# Altium project Asterisk Main Board.PrjPCB
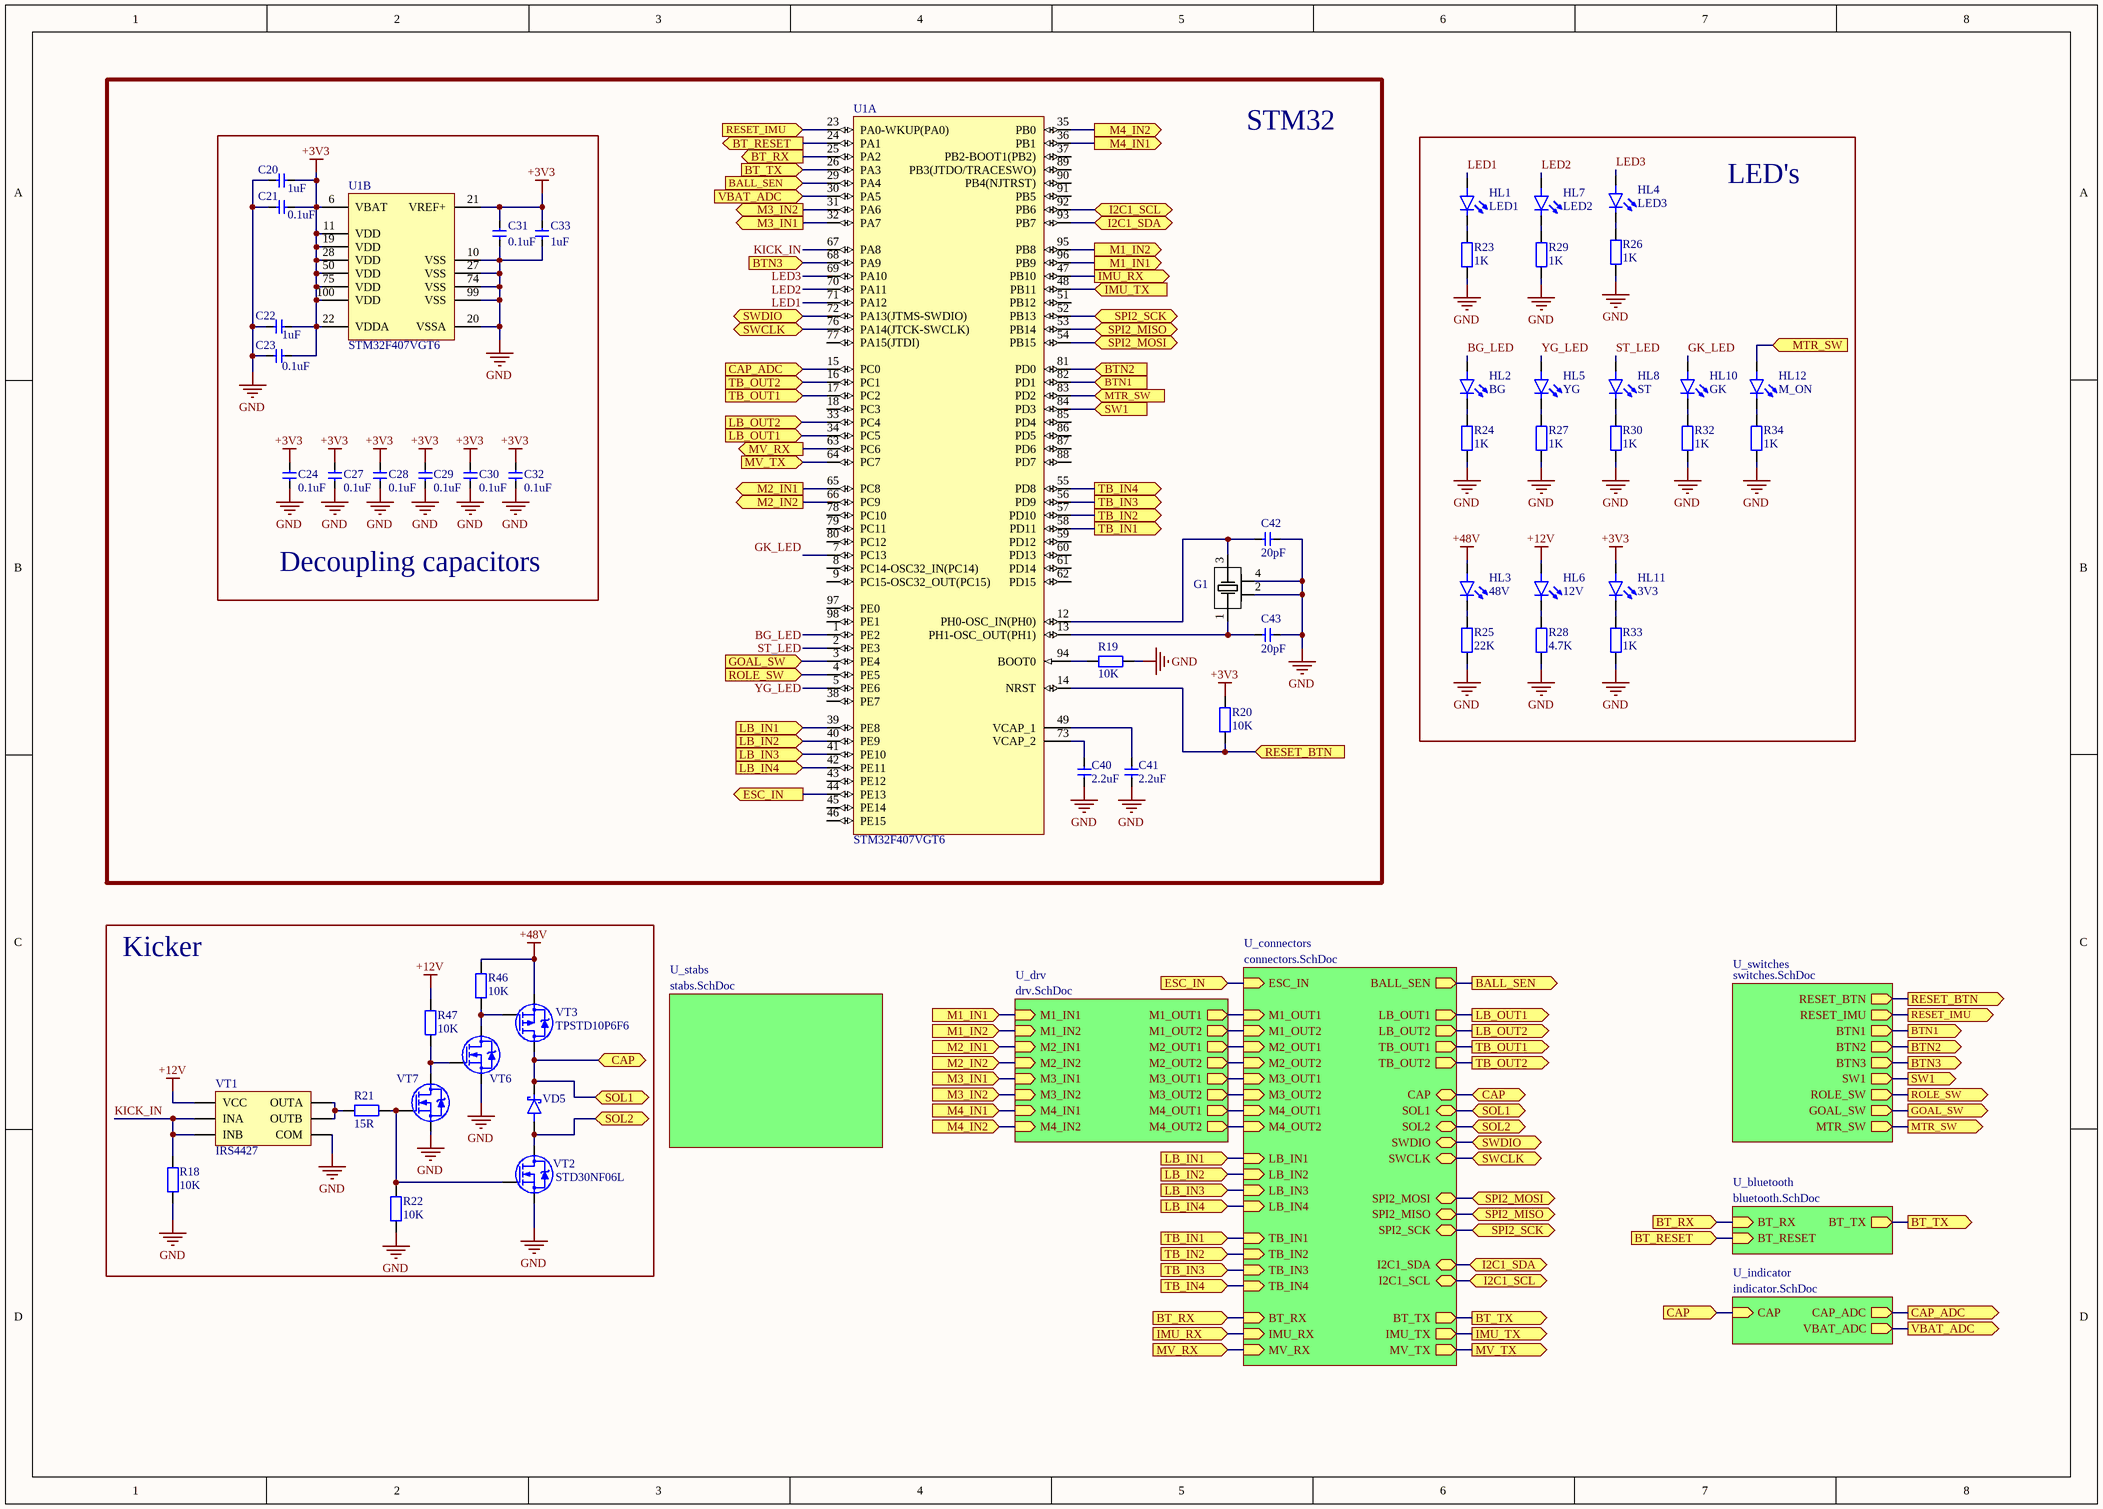
[diagram p0: main.SchDoc]
6 sheets, 167 parts. Net scope: hierarchical (ports join the sheet entries above them; power ports are global).
Board file: main.PcbDoc
Sheets:
  main.SchDoc
    U_drv = drv.SchDoc
    U_bluetooth = bluetooth.SchDoc
    U_indicator = indicator.SchDoc
    U_connectors = connectors.SchDoc
    U_stabs = stabs.SchDoc

## Sheet main.SchDoc
size A3

### Parts
C20  1uF  [CAP0805]
C21  0.1uF  [CAP0805]
C22  1uF  [CAP0805]
C23  0.1uF  [CAP0805]
C24  0.1uF  [CAP0805]
C27  0.1uF  [CAP0805]
C28  0.1uF  [CAP0805]
C29  0.1uF  [CAP0805]
C30  0.1uF  [CAP0805]
C31  0.1uF  [CAP0805]
C32  0.1uF  [CAP0805]
C33  1uF  [CAP0805]
C40  2.2uF  [CAP0805]
C41  2.2uF  [CAP0805]
C42  20pF  [CAP0805]
C43  20pF  [CAP0805]
G1  8 MHz  [TSX-3225]  (value not drawn)
HL1  LED1  [LED0603_WHITE]
HL2  BG  [LED0603_WHITE]
HL3  48V  [LED0603_GREEN]
HL4  LED3  [LED0603_WHITE]
HL5  YG  [LED0603_WHITE]
HL6  12V  [LED0603_GREEN]
HL7  LED2  [LED0603_WHITE]
HL8  ST  [LED0603_WHITE]
HL10  GK  [LED0603_WHITE]
HL11  3V3  [LED0603_GREEN]
HL12  M_ON  [LED0603_RED]
R18  10K  [RES0805]
R19  10K  [RES0805]
R20  10K  [RES0805]
R21  15R  [RES1206]
R22  10K  [RES0805]
R23  1K  [RES0805]
R24  1K  [RES0805]
R25  22K  [RES0805]
R26  1K  [RES0805]
R27  1K  [RES0805]
R28  4.7K  [RES0805]
R29  1K  [RES0805]
R30  1K  [RES0805]
R32  1K  [RES0805]
R33  1K  [RES0805]
R34  1K  [RES0805]
R46  10K  [RES0805]
R47  10K  [RES0805]
U1  STM32F407VGT6  [LQFP100]  (parts A,B of 2)
VD5  Diode Schottky  [DO-214AC (SMA)]  (value not drawn)
VT1  IRS4427  [SOIC-8]
VT2  STD30NF06L  [DPAK]
VT3  TPSTD10P6F6  [DPAK]
VT6  IRLML2502  [SOT-23-3]  (value not drawn)
VT7  IRLML2502  [SOT-23-3]  (value not drawn)

### Blocks framed on the sheet
STM32: C40-C43 G1 R19 R20 U1
Decoupling capacitors: C20-C24 C27-C33 U1
LED's: HL1-HL8 HL10-HL12 R23-R30 R32-R34
Kicker: R18 R21 R22 R46 R47 VD5 VT1-VT3 VT6 VT7

### Sub-sheets
U_bluetooth = bluetooth.SchDoc: BT_TX (out), BT_RX (in), BT_RESET (in)
U_connectors = connectors.SchDoc: ESC_IN (in), M1_OUT1 (in), M1_OUT2 (in), M2_OUT1 (in), M2_OUT2 (in), M3_OUT1 (in), M3_OUT2 (in), M4_OUT1 (in), M4_OUT2 (in), SOL2 (bidir), SOL1 (bidir), CAP (bidir), BALL_SEN (out), SWDIO (bidir), SWCLK (bidir), LB_OUT2 (out), LB_OUT1 (out), LB_IN1 (in), LB_IN2 (in), LB_IN3 (in), LB_IN4 (in), TB_IN1 (in), TB_IN2 (in), TB_IN3 (in), TB_IN4 (in), TB_OUT1 (out), TB_OUT2 (out), BT_TX (out), BT_RX (in), IMU_RX (in), IMU_TX (out), MV_RX (in), MV_TX (out), SPI2_MOSI (bidir), I2C1_SCL (bidir), I2C1_SDA (bidir), SPI2_SCK (bidir), SPI2_MISO (bidir)
U_drv = drv.SchDoc: M1_IN1 (in), M1_IN2 (in), M1_OUT1 (out), M1_OUT2 (out), M2_IN1 (in), M2_IN2 (in), M2_OUT1 (out), M2_OUT2 (out), M4_IN1 (in), M4_IN2 (in), M4_OUT1 (out), M4_OUT2 (out), M3_IN1 (in), M3_IN2 (in), M3_OUT1 (out), M3_OUT2 (out)
U_indicator = indicator.SchDoc: VBAT_ADC (out), CAP (in), CAP_ADC (out)
U_stabs = stabs.SchDoc: no entries
U_switches = switches.SchDoc (file not in this document): RESET_BTN (out), RESET_IMU (out), BTN1 (out), BTN2 (out), BTN3 (out), SW1 (out), ROLE_SW (out), GOAL_SW (out), MTR_SW (out)

### Ports
BALL_SEN (in), BALL_SEN (out), BT_RESET (in), BT_RESET (out), BT_RX (in), BT_RX (out), BT_TX (in), BT_TX (out), BTN1 (in), BTN1 (out), BTN2 (in), BTN2 (out), BTN3 (in), BTN3 (out), CAP (bidir), CAP (in), CAP_ADC (in), CAP_ADC (out), ESC_IN (in), ESC_IN (out), GOAL_SW (in), GOAL_SW (out), I2C1_SCL (bidir), I2C1_SDA (bidir), IMU_RX (in), IMU_RX (out), IMU_TX (in), IMU_TX (out), LB_IN1 (in), LB_IN2 (in), LB_IN3 (in), LB_IN4 (in), LB_OUT1 (in), LB_OUT1 (out), LB_OUT2 (in), LB_OUT2 (out), M1_IN1 (in), M1_IN1 (out), M1_IN2 (in), M1_IN2 (out), M2_IN1 (in), M2_IN1 (out), M2_IN2 (in), M2_IN2 (out), M3_IN1 (in), M3_IN1 (out), M3_IN2 (in), M3_IN2 (out), M4_IN1 (in), M4_IN1 (out), M4_IN2 (in), M4_IN2 (out), MTR_SW (in), MTR_SW (out), MV_RX (in), MV_RX (out), MV_TX (in), MV_TX (out), RESET_BTN (in), RESET_BTN (out), RESET_IMU (in), RESET_IMU (out), ROLE_SW (in), ROLE_SW (out), SOL1 (bidir), SOL2 (bidir), SPI2_MISO (bidir), SPI2_MOSI (bidir), SPI2_SCK (bidir), SW1 (in), SW1 (out), SWCLK (bidir), SWDIO (bidir), TB_IN1 (in), TB_IN1 (out), TB_IN2 (in), TB_IN2 (out), TB_IN3 (in), TB_IN3 (out), TB_IN4 (in), TB_IN4 (out), TB_OUT1 (in), TB_OUT1 (out), TB_OUT2 (in), TB_OUT2 (out), VBAT_ADC (in), VBAT_ADC (out)

### Nets
+3V3: C20.1 C21.1 C22.1 C23.1 C24.1 C27.1 C28.1 C29.1 C30.1 C31.2 C32.1 C33.2 HL11.2(A) R20.1 U1.6(VBAT) U1.11(VDD) U1.19(VDD) U1.21(VREF+) U1.22(VDDA) U1.28(VDD) U1.50(VDD) U1.75(VDD) U1.100(VDD)
+12V: HL6.2(A) R47.2 VT1.6(VCC)
+48V: HL3.2(A) R46.2 VT3.S
GND: C20.2 C21.2 C22.2 C23.2 C24.2 C27.2 C28.2 C29.2 C30.2 C31.1 C32.2 C33.1 C40.1 C41.1 C42.2 C43.2 G1.2 G1.4 R18.1 R19.1 R22.1 R23.1 R24.1 R25.1 R26.1 R27.1 R28.1 R29.1 R30.1 R32.1 R33.1 R34.1 U1.10(VSS) U1.20(VSSA) U1.27(VSS) U1.74(VSS) U1.99(VSS) VT1.3(COM) VT2.S VT6.S VT7.S
BALL_SEN: U1.29(PA4) ; port BALL_SEN, sheet U_connectors/BALL_SEN
BG_LED: HL2.2(A) U1.1(PE2)
BT_RESET: U1.24(PA1) ; port BT_RESET, sheet U_bluetooth/BT_RESET
BT_RX: U1.25(PA2) ; port BT_RX, sheet U_bluetooth/BT_RX, sheet U_connectors/BT_RX
BT_TX: U1.26(PA3) ; port BT_TX, sheet U_bluetooth/BT_TX, sheet U_connectors/BT_TX
BTN1: U1.82(PD1) ; port BTN1, sheet U_switches/BTN1
BTN2: U1.81(PD0) ; port BTN2, sheet U_switches/BTN2
BTN3: U1.68(PA9) ; port BTN3, sheet U_switches/BTN3
CAP: VD5.K VT3.D ; port SOL1, port CAP, sheet U_indicator/CAP, sheet U_connectors/SOL1, sheet U_connectors/CAP
CAP_ADC: U1.15(PC0) ; port CAP_ADC, sheet U_indicator/CAP_ADC
ESC_IN: U1.44(PE13) ; port ESC_IN, sheet U_connectors/ESC_IN
GK_LED: HL10.2(A) U1.7(PC13)
GOAL_SW: U1.3(PE4) ; port GOAL_SW, sheet U_switches/GOAL_SW
I2C1_SCL: U1.92(PB6) ; port I2C1_SCL, sheet U_connectors/I2C1_SCL
I2C1_SDA: U1.93(PB7) ; port I2C1_SDA, sheet U_connectors/I2C1_SDA
IMU_RX: U1.47(PB10) ; port IMU_RX, sheet U_connectors/IMU_RX
IMU_TX: U1.48(PB11) ; port IMU_TX, sheet U_connectors/IMU_TX
KICK_IN: R18.2 U1.67(PA8) VT1.2(INA) VT1.4(INB)
LB_IN1: U1.39(PE8) ; port LB_IN1, sheet U_connectors/LB_IN1
LB_IN2: U1.40(PE9) ; port LB_IN2, sheet U_connectors/LB_IN2
LB_IN3: U1.41(PE10) ; port LB_IN3, sheet U_connectors/LB_IN3
LB_IN4: U1.42(PE11) ; port LB_IN4, sheet U_connectors/LB_IN4
LB_OUT1: U1.34(PC5) ; port LB_OUT1, sheet U_connectors/LB_OUT1
LB_OUT2: U1.33(PC4) ; port LB_OUT2, sheet U_connectors/LB_OUT2
LED1: HL1.2(A) U1.71(PA12)
LED2: HL7.2(A) U1.70(PA11)
LED3: HL4.2(A) U1.69(PA10)
M1_IN1: U1.96(PB9) ; port M1_IN1, sheet U_drv/M1_IN1
M1_IN2: U1.95(PB8) ; port M1_IN2, sheet U_drv/M1_IN2
M1_OUT1: sheet U_drv/M1_OUT1, sheet U_connectors/M1_OUT1
M1_OUT2: sheet U_drv/M1_OUT2, sheet U_connectors/M1_OUT2
M2_IN1: U1.65(PC8) ; port M2_IN1, sheet U_drv/M2_IN1
M2_IN2: U1.66(PC9) ; port M2_IN2, sheet U_drv/M2_IN2
M2_OUT1: sheet U_drv/M2_OUT1, sheet U_connectors/M2_OUT1
M2_OUT2: sheet U_drv/M2_OUT2, sheet U_connectors/M2_OUT2
M3_IN1: U1.32(PA7) ; port M3_IN1, sheet U_drv/M3_IN1
M3_IN2: U1.31(PA6) ; port M3_IN2, sheet U_drv/M3_IN2
M3_OUT1: sheet U_drv/M3_OUT1, sheet U_connectors/M3_OUT1
M3_OUT2: sheet U_drv/M3_OUT2, sheet U_connectors/M3_OUT2
M4_IN1: U1.36(PB1) ; port M4_IN1, sheet U_drv/M4_IN1
M4_IN2: U1.35(PB0) ; port M4_IN2, sheet U_drv/M4_IN2
M4_OUT1: sheet U_drv/M4_OUT1, sheet U_connectors/M4_OUT1
M4_OUT2: sheet U_drv/M4_OUT2, sheet U_connectors/M4_OUT2
MTR_SW: HL12.2(A) U1.83(PD2) ; port MTR_SW, sheet U_switches/MTR_SW
MV_RX: U1.63(PC6) ; port MV_RX, sheet U_connectors/MV_RX
MV_TX: U1.64(PC7) ; port MV_TX, sheet U_connectors/MV_TX
RESET_BTN: R20.2 U1.14(NRST) ; port RESET_BTN, sheet U_switches/RESET_BTN
RESET_IMU: U1.23(PA0-WKUP(PA0)) ; port RESET_IMU, sheet U_switches/RESET_IMU
ROLE_SW: U1.4(PE5) ; port ROLE_SW, sheet U_switches/ROLE_SW
SOL2: VD5.A VT2.D ; port SOL2, sheet U_connectors/SOL2
SPI2_MISO: U1.53(PB14) ; port SPI2_MISO, sheet U_connectors/SPI2_MISO
SPI2_MOSI: U1.54(PB15) ; port SPI2_MOSI, sheet U_connectors/SPI2_MOSI
SPI2_SCK: U1.52(PB13) ; port SPI2_SCK, sheet U_connectors/SPI2_SCK
ST_LED: HL8.2(A) U1.2(PE3)
SW1: U1.84(PD3) ; port SW1, sheet U_switches/SW1
SWCLK: U1.76(PA14(JTCK-SWCLK)) ; port SWCLK, sheet U_connectors/SWCLK
SWDIO: U1.72(PA13(JTMS-SWDIO)) ; port SWDIO, sheet U_connectors/SWDIO
TB_IN1: U1.58(PD11) ; port TB_IN1, sheet U_connectors/TB_IN1
TB_IN2: U1.57(PD10) ; port TB_IN2, sheet U_connectors/TB_IN2
TB_IN3: U1.56(PD9) ; port TB_IN3, sheet U_connectors/TB_IN3
TB_IN4: U1.55(PD8) ; port TB_IN4, sheet U_connectors/TB_IN4
TB_OUT1: U1.17(PC2) ; port TB_OUT1, sheet U_connectors/TB_OUT1
TB_OUT2: U1.16(PC1) ; port TB_OUT2, sheet U_connectors/TB_OUT2
VBAT_ADC: U1.30(PA5) ; port VBAT_ADC, sheet U_indicator/VBAT_ADC
YG_LED: HL5.2(A) U1.5(PE6)
NetC40_2: C40.2 U1.73(VCAP_2)
NetC41_2: C41.2 U1.49(VCAP_1)
NetC42_1: C42.1 G1.3 U1.12(PH0-OSC_IN(PH0))
NetC43_1: C43.1 G1.1 U1.13(PH1-OSC_OUT(PH1))
NetHL1_1: HL1.1(K) R23.2
NetHL2_1: HL2.1(K) R24.2
NetHL3_1: HL3.1(K) R25.2
NetHL4_1: HL4.1(K) R26.2
NetHL5_1: HL5.1(K) R27.2
NetHL6_1: HL6.1(K) R28.2
NetHL7_1: HL7.1(K) R29.2
NetHL8_1: HL8.1(K) R30.2
NetHL10_1: HL10.1(K) R32.2
NetHL11_1: HL11.1(K) R33.2
NetHL12_1: HL12.1(K) R34.2
NetR19_2: R19.2 U1.94(BOOT0)
NetR21_1: R21.1 VT1.5(OUTB) VT1.7(OUTA)
NetR21_2: R21.2 R22.2 VT2.G VT7.G
NetR46_1: R46.1 VT3.G VT6.D
NetR47_1: R47.1 VT6.G VT7.D

Not connected (* = marked no-connect by the designer): U1 8(PC14-OSC32_IN(PC14)) 9(PC15-OSC32_OUT(PC15)) 18(PC3) 37(PB2-BOOT1(PB2)) 38(PE7) 43(PE12) 45(PE14) 46(PE15) 51(PB12) 59(PD12) 60(PD13) 61(PD14) 62(PD15) 77(PA15(JTDI)) 78(PC10) 79(PC11) 80(PC12) 85(PD4) 86(PD5) 87(PD6) 88(PD7) 89(PB3(JTDO/TRACESWO)) 90(PB4(NJTRST)) 91(PB5) 97(PE0) 98(PE1)

### Library data of the parts
C20-C24 C27-C33 C40-C43 = CAP Ceramic: Ceramic SMD Cap
G1 = TSX-3225 24.0000MF15X-AC6: 24MHz ±10ppm Crystal 9pF 40 Ohms 4-SMD, No Lead; Part Number: TSX-3225 24.0000MF15X-AC6; HelpURL: https://www.digikey.com/en/products/detail/epson/TSX-3225-24-0000MF15X-AC6/5261221; Price$: 0.33; Digi-Key Part Number: SER4180CT-ND; Manufacturer Part Number: TSX-3225 24.0000MF15X-AC6
HL1-HL8 HL10-HL12 = LED: LED smd
R18-R30 R32-R34 R46 R47 = RES: RES smd
U1 = STM32F407VGT6: ARM Cortex-M4 32-bit MCU+FPU, 210 DMIPS, 1024 kB Flash, 192 kB Internal RAM, 82 I/Os, 100-pin LQFP, -40 to 85 degC, Tray; Manufacturer: STMicroelectronics; D/A Converter: 2x12-bit; FLASH Size (Prog) (kB): 1024; I/Os (High Current): 82; Internal RAM Size (kB): 192; Operating Frequency(F) (Processor speed) (MHz): 168; Supply Voltage(Vcc) max (V): 3.6; Supply Voltage(Vcc) min (V): 1.8; DatasheetVersion: Rev. 4; PackageVersion: Rev. 1, 06/2013; PackageReference: LQFP100; PackageDescription: 100-Pin Low Profile Quad Flat Package, 14 x 14 mm Body, 0.5 mm Pitch; Supplier 1: Digi-Key; Supplier Part Number 1: 497-11605-ND; Supplier 2: Farnell; Supplier Part Number 2: 2064368; Supplier 3: Newark; Supplier Part Number 3: 73T2333; Supplier 4: Mouser; Supplier Part Number 4: 511-STM32F407VGT6; Core: ARM Cortex-M4; Packing: Tray; Mounting Technology: Surface Mount; PartNumber: STM32F407VGT6; ComponentLink1Description: Manufacturer URL; ComponentLink1URL: http://www.st.com/web/en/home.html; ComponentLink2Description: Datasheet; ComponentLink2URL: http://www.st.com/st-web-ui/static/active/en/resource/technical/document/datasheet/DM00037051.pdf; ComponentLink3Description: Package Specification; ComponentLink3URL: http://www.st.com/st-web-ui/static/active/en/resource/technical/document/data_brief/DM00071938.pdf
VT1 = IRS4427: Mosfet driver
VT2 = STD30NF06L: N-MOSFET / Uds = 60 V / Ids = 30 A / Rds = 0.023 Ohm / P = 55 W; ComponentLink1Description: Chipdip; ComponentLink1URL: https://www.chipdip.ru/product/std30nf06l-umw
VT3 = TPSTD10P6F6: P-MOSFET / Uds = 60 V / Ids = 13 A / Rds = 0.100 Ohm / P = 60 W; ComponentLink1Description: Chipdip; ComponentLink1URL: https://www.chipdip.ru/product/tpstd10p6f6
VT6 = IRLML2502: N-MOSFET / Uds = 20 V / Ids = 4.2 A / Rds = 0.035 Ohm / P = 1,25 W; ComponentLink1Description: Chipdip; ComponentLink1URL: https://www.chipdip.ru/product/irlml2502-umw
VT7 = IRLML2502: N-MOSFET / Uds = 20 V / Ids = 4.2 A / Rds = 0.035 Ohm / P = 8 W; ComponentLink1Description: Chipdip; ComponentLink1URL: https://www.chipdip.ru/product/irlml2502-umw

## Sheet drv.SchDoc
size A4
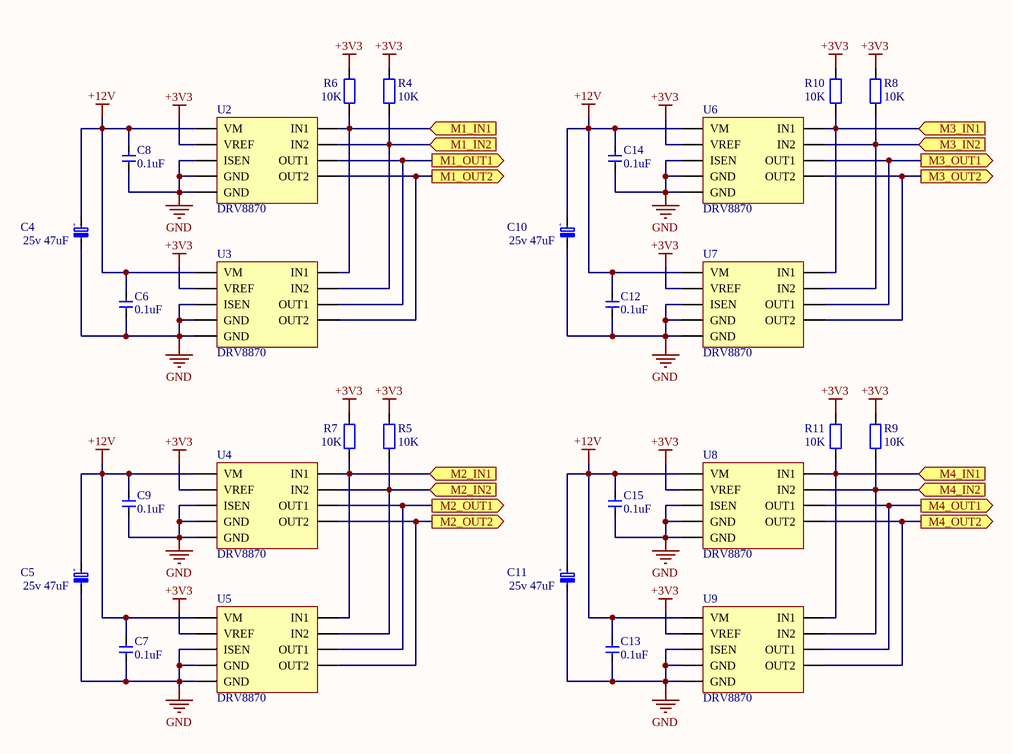
[diagram p1: drv.SchDoc]

### Parts
C4  25v 47uF  [CAP_TANT_D]
C5  25v 47uF  [CAP_TANT_D]
C6  0.1uF  [CAP0805]
C7  0.1uF  [CAP0805]
C8  0.1uF  [CAP0805]
C9  0.1uF  [CAP0805]
C10  25v 47uF  [CAP_TANT_D]
C11  25v 47uF  [CAP_TANT_D]
C12  0.1uF  [CAP0805]
C13  0.1uF  [CAP0805]
C14  0.1uF  [CAP0805]
C15  0.1uF  [CAP0805]
R4  10K  [RES0805]
R5  10K  [RES0805]
R6  10K  [RES0805]
R7  10K  [RES0805]
R8  10K  [RES0805]
R9  10K  [RES0805]
R10  10K  [RES0805]
R11  10K  [RES0805]
U2  DRV8870  [DRV8870]
U3  DRV8870  [DRV8870]
U4  DRV8870  [DRV8870]
U5  DRV8870  [DRV8870]
U6  DRV8870  [DRV8870]
U7  DRV8870  [DRV8870]
U8  DRV8870  [DRV8870]
U9  DRV8870  [DRV8870]

### Ports
M1_IN1 (in), M1_IN2 (in), M1_OUT1 (out), M1_OUT2 (out), M2_IN1 (in), M2_IN2 (in), M2_OUT1 (out), M2_OUT2 (out), M3_IN1 (in), M3_IN2 (in), M3_OUT1 (out), M3_OUT2 (out), M4_IN1 (in), M4_IN2 (in), M4_OUT1 (out), M4_OUT2 (out)

### Nets
+3V3: R4.2 R5.2 R6.2 R7.2 R8.2 R9.2 R10.2 R11.2 U2.4(VREF) U3.4(VREF) U4.4(VREF) U5.4(VREF) U6.4(VREF) U7.4(VREF) U8.4(VREF) U9.4(VREF)
+12V: C4.2(PLUS) C5.2(PLUS) C6.2 C7.2 C8.2 C9.2 C10.2(PLUS) C11.2(PLUS) C12.2 C13.2 C14.2 C15.2 U2.5(VM) U3.5(VM) U4.5(VM) U5.5(VM) U6.5(VM) U7.5(VM) U8.5(VM) U9.5(VM)
GND: C4.1(MINUS) C5.1(MINUS) C6.1 C7.1 C8.1 C9.1 C10.1(MINUS) C11.1(MINUS) C12.1 C13.1 C14.1 C15.1 U2.1(GND) U2.7(ISEN) U2.9(GND) U3.1(GND) U3.7(ISEN) U3.9(GND) U4.1(GND) U4.7(ISEN) U4.9(GND) U5.1(GND) U5.7(ISEN) U5.9(GND) U6.1(GND) U6.7(ISEN) U6.9(GND) U7.1(GND) U7.7(ISEN) U7.9(GND) U8.1(GND) U8.7(ISEN) U8.9(GND) U9.1(GND) U9.7(ISEN) U9.9(GND)
M1_IN1: R6.1 U2.3(IN1) U3.3(IN1) ; port M1_IN1
M1_IN2: R4.1 U2.2(IN2) U3.2(IN2) ; port M1_IN2
M1_OUT1: U2.6(OUT1) U3.6(OUT1) ; port M1_OUT1
M1_OUT2: U2.8(OUT2) U3.8(OUT2) ; port M1_OUT2
M2_IN1: R7.1 U4.3(IN1) U5.3(IN1) ; port M2_IN1
M2_IN2: R5.1 U4.2(IN2) U5.2(IN2) ; port M2_IN2
M2_OUT1: U4.6(OUT1) U5.6(OUT1) ; port M2_OUT1
M2_OUT2: U4.8(OUT2) U5.8(OUT2) ; port M2_OUT2
M3_IN1: R10.1 U6.3(IN1) U7.3(IN1) ; port M3_IN1
M3_IN2: R8.1 U6.2(IN2) U7.2(IN2) ; port M3_IN2
M3_OUT1: U6.6(OUT1) U7.6(OUT1) ; port M3_OUT1
M3_OUT2: U6.8(OUT2) U7.8(OUT2) ; port M3_OUT2
M4_IN1: R11.1 U8.3(IN1) U9.3(IN1) ; port M4_IN1
M4_IN2: R9.1 U8.2(IN2) U9.2(IN2) ; port M4_IN2
M4_OUT1: U8.6(OUT1) U9.6(OUT1) ; port M4_OUT1
M4_OUT2: U8.8(OUT2) U9.8(OUT2) ; port M4_OUT2

### Notes on the sheet
- (in symbol CAP Tantal) +

### Library data of the parts
C4 C5 C10 C11 = CAP Tantal: Tantal SMD Cap
C6-C9 C12-C15 = CAP Ceramic: Ceramic SMD Cap
R4-R11 = RES: RES smd
U2-U9 = DRV8870: DC motor driver 3.6A

## Sheet bluetooth.SchDoc
size A4
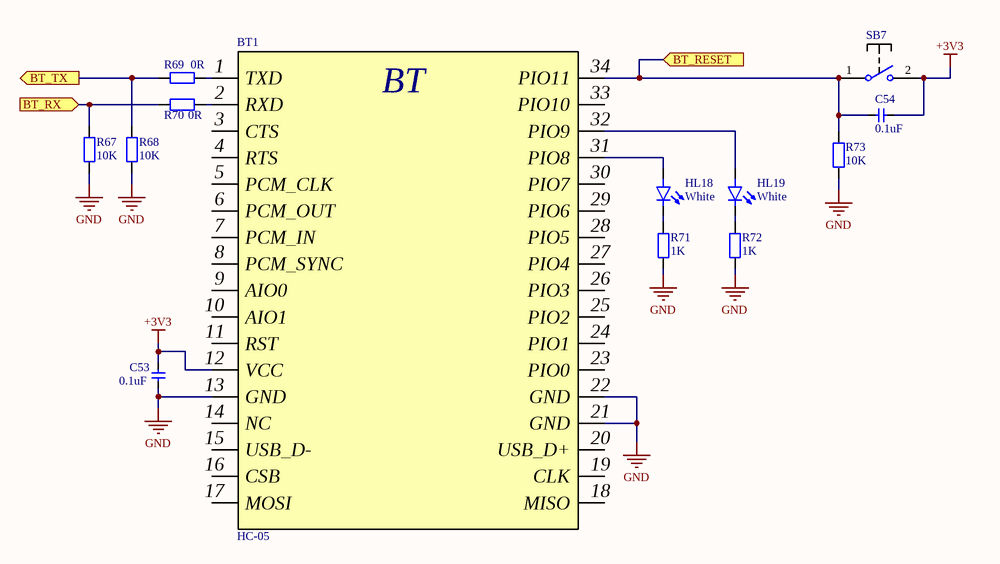
[diagram p2: bluetooth.SchDoc]

### Parts
BT1  HC-05  [HC-05]
C53  0.1uF  [CAP0805]
C54  0.1uF  [CAP0805]
HL18  White  [LED0603_WHITE]
HL19  White  [LED0603_WHITE]
R67  10K  [RES0805]
R68  10K  [RES0805]
R69  0R  [RES0805]
R70  0R  [RES0805]
R71  1K  [RES0805]
R72  1K  [RES0805]
R73  10K  [RES0805]
SB7  PTS636 SP43 LFS  [PTS636 SP43 LFS]  (value not drawn)

### Ports
BT_RESET (in), BT_RX (in), BT_TX (out)

### Nets
+3V3: BT1.12(VCC) C53.2 C54.1 SB7.2(NO)
GND: BT1.13(GND) BT1.21(GND) BT1.22(GND) C53.1 R67.1 R68.1 R71.1 R72.1 R73.1
BT_RESET: BT1.34(PIO11) C54.2 R73.2 SB7.1(COMMON) ; port BT_RESET
BT_RX: R67.2 R70.2 ; port BT_RX
BT_TX: R68.2 R69.2 ; port BT_TX
NetBT1_1: BT1.1(TXD) R69.1
NetBT1_2: BT1.2(RXD) R70.1
NetBT1_31: BT1.31(PIO8) HL18.2(A)
NetBT1_32: BT1.32(PIO9) HL19.2(A)
NetHL18_1: HL18.1(K) R71.2
NetHL19_1: HL19.1(K) R72.2

Not connected (* = marked no-connect by the designer): BT1 3(CTS) 4(RTS) 5(PCM_CLK) 6(PCM_OUT) 7(PCM_IN) 8(PCM_SYNC) 9(AIO0) 10(AIO1) 11(RST) 14(NC) 15(USB_D-) 16(CSB) 17(MOSI) 18(MISO) 19(CLK) 20(USB_D+) 23(PIO0) 24(PIO1) 25(PIO2) 26(PIO3) 27(PIO4) 28(PIO5) 29(PIO6) 30(PIO7) 33(PIO10)

### Notes on the sheet
- (in symbol HC-05) BT

### Library data of the parts
BT1 = HC-05: Bluetooth HC-05; ComponentLink1Description: Chipdip; ComponentLink1URL: https://www.chipdip.ru/product0/8020390968
C53 C54 = CAP Ceramic: Ceramic SMD Cap
HL18 HL19 = LED: LED smd
R67-R73 = RES: RES smd
SB7 = PTS636 SP43 LFS: TACT 6.0 X 3.5, 4.3 MM H, 320GF,; Part Number: PTS636 SP43 LFS; HelpURL: https://www.digikey.com/product-detail/en/c-k/PTS636-SP43-LFS/CKN12304-ND/10071717; Digi-Key Part Number: CKN12304-ND; Price$: 0.1; Manufacturer Part Number: PTS636 SP43 LFS

## Sheet indicator.SchDoc
size A4
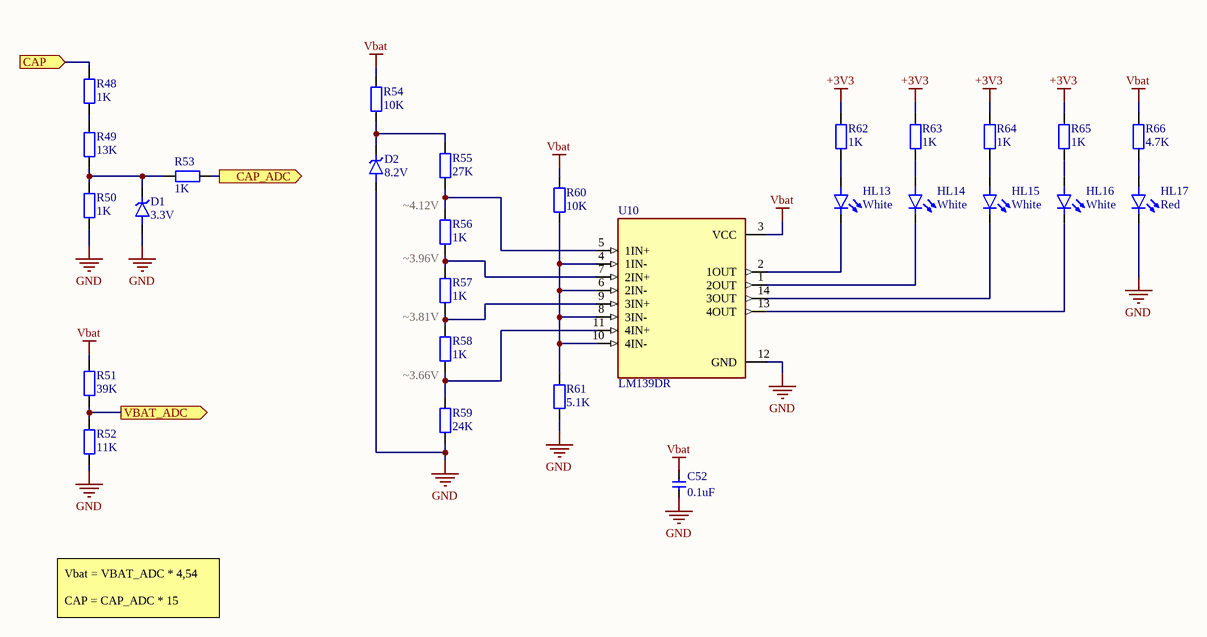
[diagram p3: indicator.SchDoc]

### Parts
C52  0.1uF  [CAP0805]
D1  3.3V  [SOD-80]
D2  8.2V  [SOD-80]
HL13  White  [LED0603_GREEN]
HL14  White  [LED0603_GREEN]
HL15  White  [LED0603_GREEN]
HL16  White  [LED0603_GREEN]
HL17  Red  [LED0603_RED]
R48  1K  [RES0805]
R49  13K  [RES0805]
R50  1K  [RES0805]
R51  39K  [RES0805]
R52  11K  [RES0805]
R53  1K  [RES0805]
R54  10K  [RES0805]
R55  27K  [RES0805]
R56  1K  [RES0805]
R57  1K  [RES0805]
R58  1K  [RES0805]
R59  24K  [RES0805]
R60  10K  [RES0805]
R61  5.1K  [RES0805]
R62  1K  [RES0805]
R63  1K  [RES0805]
R64  1K  [RES0805]
R65  1K  [RES0805]
R66  4.7K  [RES0805]
U10  LM139DR  [SOIC-14]

### Ports
CAP (in), CAP_ADC (out), VBAT_ADC (out)

### Nets
+3V3: R62.2 R63.2 R64.2 R65.2
GND: C52.1 D1.A D2.A HL17.1(K) R50.1 R52.1 R59.1 R61.1 U10.12(GND)
Vbat: C52.2 R51.2 R54.2 R60.2 R66.2 U10.3(VCC)
CAP: R48.2 ; port CAP
CAP_ADC: R53.1 ; port CAP_ADC
VBAT_ADC: R51.1 R52.2 ; port VBAT_ADC
NetD1_K: D1.K R49.1 R50.2 R53.2
NetD2_K: D2.K R54.1 R55.2
NetHL13_1: HL13.1(K) U10.2(1OUT)
NetHL13_2: HL13.2(A) R62.1
NetHL14_1: HL14.1(K) U10.1(2OUT)
NetHL14_2: HL14.2(A) R63.1
NetHL15_1: HL15.1(K) U10.14(3OUT)
NetHL15_2: HL15.2(A) R64.1
NetHL16_1: HL16.1(K) U10.13(4OUT)
NetHL16_2: HL16.2(A) R65.1
NetHL17_2: HL17.2(A) R66.1
NetR48_1: R48.1 R49.2
NetR55_1: R55.1 R56.2 U10.5(1IN+)
NetR56_1: R56.1 R57.2 U10.7(2IN+)
NetR57_1: R57.1 R58.2 U10.9(3IN+)
NetR58_1: R58.1 R59.2 U10.11(4IN+)
NetR60_1: R60.1 R61.2 U10.4(1IN-) U10.6(2IN-) U10.8(3IN-) U10.10(4IN-)

### Notes on the sheet
- (near R56) ~4.12V
- ~3.96V
- ~3.81V
- (near R58) ~3.66V
- Vbat = VBAT_ADC * 4,54
  CAP = CAP_ADC * 15

### Library data of the parts
C52 = CAP Ceramic: Ceramic SMD Cap
D1 D2 = Diode Zener: Zener Diode / BZV55C8V2
HL13-HL17 = LED: LED smd
R48-R66 = RES: RES smd
U10 = LM139DR: Quad differential comparator; ComponentLink1Description: Chipdip; ComponentLink1URL: https://www.chipdip.ru/product0/8013766664

## Sheet connectors.SchDoc
size A4
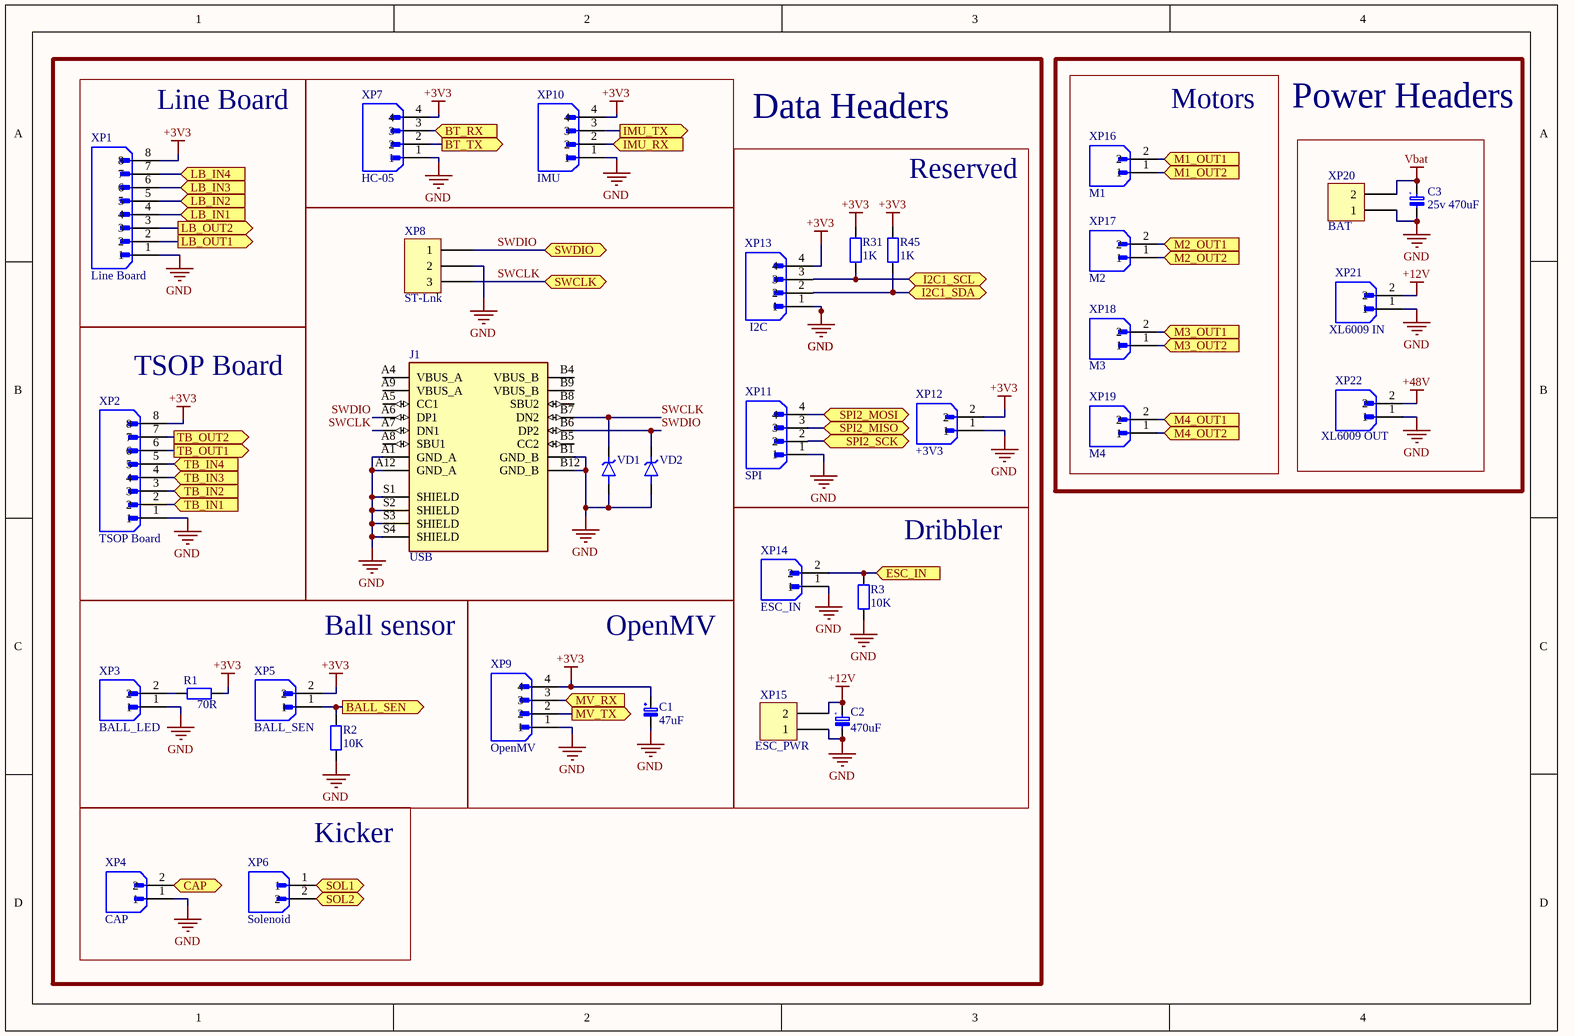
[diagram p4: connectors.SchDoc]

### Parts
C1  47uF  [CAP_TANT_D]
C2  470uF  [D10C4.4H10]
C3  25v 470uF  [D10C4.4H10]
J1  USB  [USB-C VERTICAL]
R1  70R  [RES0805]
R2  10K  [RES0805]
R3  10K  [RES0805]
R31  1K  [RES0805]
R45  1K  [RES0805]
VD1  Diode TVS  [DO-214AC (SMA)]  (value not drawn)
VD2  Diode TVS  [DO-214AC (SMA)]  (value not drawn)
XP1  Line Board  [JST_XH-8]
XP2  TSOP Board  [JST_XH-8]
XP3  BALL_LED  [JST_XH-2]
XP4  CAP  [JST_XH-2]
XP5  BALL_SEN  [JST_XH-2]
XP6  Solenoid  [JST_XH-2]
XP7  HC-05  [JST_XH-4]
XP8  ST-Lnk  [3x2.54]
XP9  OpenMV  [JST_XH-4]
XP10  IMU  [JST_XH-4]
XP11  SPI  [JST_XH-4 (clear)]
XP12  +3V3  [JST_XH-2]
XP13  I2C  [JST_XH-4]
XP14  ESC_IN  [JST_XH-2]
XP15  ESC_PWR  [XT30_3D]
XP16  M1  [JST_XH-2]
XP17  M2  [JST_XH-2]
XP18  M3  [JST_XH-2]
XP19  M4  [JST_XH-2]
XP20  BAT  [XT30_3D]
XP21  XL6009 IN  [JST_XH-2]
XP22  XL6009 OUT  [JST_XH-2]

### Blocks framed on the sheet
Data Headers: J1 VD1 VD2 XP7 XP8 XP10
Line Board: XP1
Power Headers: C3 XP20-XP22
Motors: XP16-XP19
Reserved: R31 R45 XP11-XP13
TSOP Board: XP2
Dribbler: C2 R3 XP14 XP15
Ball sensor: R1 R2 XP3 XP5
OpenMV: C1 XP9
Kicker: XP4 XP6

### Ports
BALL_SEN (out), BT_RX (in), BT_TX (out), CAP (bidir), ESC_IN (in), I2C1_SCL (bidir), I2C1_SDA (bidir), IMU_RX (in), IMU_TX (out), LB_IN1 (in), LB_IN2 (in), LB_IN3 (in), LB_IN4 (in), LB_OUT1 (out), LB_OUT2 (out), M1_OUT1 (in), M1_OUT2 (in), M2_OUT1 (in), M2_OUT2 (in), M3_OUT1 (in), M3_OUT2 (in), M4_OUT1 (in), M4_OUT2 (in), MV_RX (in), MV_TX (out), SOL1 (bidir), SOL2 (bidir), SPI2_MISO (bidir), SPI2_MOSI (bidir), SPI2_SCK (bidir), SWCLK (bidir), SWDIO (bidir), TB_IN1 (in), TB_IN2 (in), TB_IN3 (in), TB_IN4 (in), TB_OUT1 (out), TB_OUT2 (out)

### Nets
+3V3: C1.2 R1.2 R31.1 R45.1 XP1.8 XP2.8 XP5.2 XP7.4 XP9.4 XP10.4 XP12.2 XP13.4
+12V: C2.1(PLUS) XP15.2 XP21.2
+48V: XP22.2
GND: C1.1 C2.2(MINUS) C3.2(MINUS) J1.A1(GND_A) J1.A12(GND_A) J1.B1(GND_B) J1.B12(GND_B) J1.S1(SHIELD) J1.S2(SHIELD) J1.S3(SHIELD) J1.S4(SHIELD) R2.1 R3.1 VD1.A VD2.A XP1.1 XP2.1 XP3.1 XP4.1 XP7.1 XP8.2 XP9.1 XP10.1 XP11.1 XP12.1 XP13.1 XP14.1 XP15.1 XP20.1 XP21.1 XP22.1
Vbat: C3.1(PLUS) XP20.2
BALL_SEN: R2.2 XP5.1 ; port BALL_SEN
BT_RX: XP7.3 ; port BT_RX
BT_TX: XP7.2 ; port BT_TX
CAP: XP4.2 XP6.1 ; port SOL1, port CAP
ESC_IN: R3.2 XP14.2 ; port ESC_IN
I2C1_SCL: R31.2 XP13.3 ; port I2C1_SCL
I2C1_SDA: R45.2 XP13.2 ; port I2C1_SDA
IMU_RX: XP10.2 ; port IMU_RX
IMU_TX: XP10.3 ; port IMU_TX
LB_IN1: XP1.4 ; port LB_IN1
LB_IN2: XP1.5 ; port LB_IN2
LB_IN3: XP1.6 ; port LB_IN3
LB_IN4: XP1.7 ; port LB_IN4
LB_OUT1: XP1.2 ; port LB_OUT1
LB_OUT2: XP1.3 ; port LB_OUT2
M1_OUT1: XP16.2 ; port M1_OUT1
M1_OUT2: XP16.1 ; port M1_OUT2
M2_OUT1: XP17.2 ; port M2_OUT1
M2_OUT2: XP17.1 ; port M2_OUT2
M3_OUT1: XP18.2 ; port M3_OUT1
M3_OUT2: XP18.1 ; port M3_OUT2
M4_OUT1: XP19.2 ; port M4_OUT1
M4_OUT2: XP19.1 ; port M4_OUT2
MV_RX: XP9.3 ; port MV_RX
MV_TX: XP9.2 ; port MV_TX
SOL2: XP6.2 ; port SOL2
SPI2_MISO: XP11.3 ; port SPI2_MISO
SPI2_MOSI: XP11.4 ; port SPI2_MOSI
SPI2_SCK: XP11.2 ; port SPI2_SCK
SWCLK: J1.A7(DN1) J1.B7(DN2) VD1.K XP8.3 ; port SWCLK
SWDIO: J1.A6(DP1) J1.B6(DP2) VD2.K XP8.1 ; port SWDIO
TB_IN1: XP2.2 ; port TB_IN1
TB_IN2: XP2.3 ; port TB_IN2
TB_IN3: XP2.4 ; port TB_IN3
TB_IN4: XP2.5 ; port TB_IN4
TB_OUT1: XP2.6 ; port TB_OUT1
TB_OUT2: XP2.7 ; port TB_OUT2
NetR1_1: R1.1 XP3.2

Not connected (* = marked no-connect by the designer): J1 A4(VBUS_A) A5(CC1) A8(SBU1) A9(VBUS_A) B4(VBUS_B) B5(CC2) B8(SBU2) B9(VBUS_B)

### Notes on the sheet
- (in symbol Cap Aluminum) +

### Library data of the parts
C1 = CAP Tantal: Tantal SMD Cap
C2 = Cap Aluminum: 25V; ComponentLink1Description: Chipdip; ComponentLink1URL: https://www.chipdip.ru/product0/9000565743
C3 = Cap Aluminum: ComponentLink1Description: Chipdip; ComponentLink1URL: https://www.chipdip.ru/product0/9000565743
J1 = USB-C: USB4145-04-0070-C
R1-R3 R31 R45 = RES: RES smd
VD1 VD2 = Diode TVS: Protective diode
XP1 XP2 = JST-XH-8: JST_B8B-XH-A(LF)(SN)
XP3-XP6 XP12 XP14 XP16-XP19 XP21 XP22 = JST-XH-2: JST_B2B-XH-A(LF)(SN)
XP7 XP9-XP11 XP13 = JST_XH-4: JST_B4B-XH-A(LF)(SN)
XP8 = Header 3
XP15 XP20 = Power connectors

## Sheet stabs.SchDoc
size A4
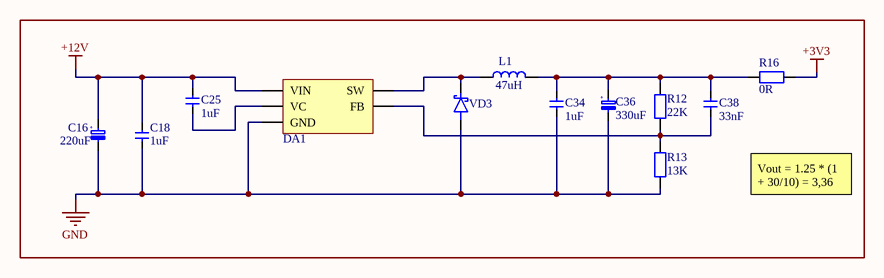
[diagram p5: stabs.SchDoc]

### Parts
C16  220uF  [D8C3.2H12]
C18  1uF  [CAP0805]
C25  1uF  [CAP0805]
C34  1uF  [CAP0805]
C36  330uF  [D10C4.4H10]
C38  33nF  [CAP0805]
DA1  XL4015  [TO263-5L]  (value not drawn)
L1  47uH  [IND: B82477G]
R12  22K  [RES0805]
R13  13K  [RES0805]
R16  0R  [RES1206]
VD3  Diode Schottky  [DO-214AC (SMA)]  (value not drawn)

### Nets
+3V3: R16.2
+12V: C16.1(PLUS) C18.2 C25.2 DA1.5(VIN)
GND: C16.2(MINUS) C18.1 C34.1 C36.2(MINUS) DA1.1(GND) R13.1 VD3.A
NetC25_1: C25.1 DA1.4(VC)
NetC34_2: C34.2 C36.1(PLUS) C38.2 L1.2 R12.2 R16.1
NetC38_1: C38.1 DA1.2(FB) R12.1 R13.2
NetDA1_3: DA1.3(SW) L1.1 VD3.K

### Notes on the sheet
- Vout = 1.25 * (1 + 30/10) = 3,36
- (in symbol Cap Aluminum) +

### Library data of the parts
C16 = Cap Aluminum: 50V; ComponentLink1Description: Chipdip; ComponentLink1URL: https://www.chipdip.ru/product0/9000565743
C18 C25 C34 C38 = CAP Ceramic: Ceramic SMD Cap
C36 = Cap Aluminum: 25V; ComponentLink1Description: Chipdip; ComponentLink1URL: https://www.chipdip.ru/product0/9000565748
DA1 = XL4015: Buck converter
L1 = Inductor: ComponentLink1Description: Chipdip; ComponentLink1URL: https://www.chipdip.ru/product/b82477g4473m
R12 R13 R16 = RES: RES smd

## Nets that join several sheets
+3V3: main (23 pins), drv (16 pins), bluetooth (BT1.12 C53.2 C54.1 SB7.2), indicator (R62.2 R63.2 R64.2 R65.2), connectors (12 pins), stabs (R16.2)
+12V: main (HL6.2 R47.2 VT1.6), drv (20 pins), connectors (C2.1 XP15.2 XP21.2), stabs (C16.1 C18.2 C25.2 DA1.5)
+48V: main (HL3.2 R46.2 VT3.S), connectors (XP22.2)
GND: main (41 pins), drv (36 pins), bluetooth (9 pins), indicator (9 pins), connectors (31 pins), stabs (7 pins)
Vbat: indicator (6 pins), connectors (C3.1 XP20.2)
BALL_SEN: main (U1.29), connectors (R2.2 XP5.1)
BT_RESET: main (U1.24), bluetooth (BT1.34 C54.2 R73.2 SB7.1)
BT_RX: main (U1.25), bluetooth (R67.2 R70.2), connectors (XP7.3)
BT_TX: main (U1.26), bluetooth (R68.2 R69.2), connectors (XP7.2)
CAP: main (VD5.K VT3.D), indicator (R48.2), connectors (XP4.2 XP6.1)
CAP_ADC: main (U1.15), indicator (R53.1)
ESC_IN: main (U1.44), connectors (R3.2 XP14.2)
I2C1_SCL: main (U1.92), connectors (R31.2 XP13.3)
I2C1_SDA: main (U1.93), connectors (R45.2 XP13.2)
IMU_RX: main (U1.47), connectors (XP10.2)
IMU_TX: main (U1.48), connectors (XP10.3)
LB_IN1: main (U1.39), connectors (XP1.4)
LB_IN2: main (U1.40), connectors (XP1.5)
LB_IN3: main (U1.41), connectors (XP1.6)
LB_IN4: main (U1.42), connectors (XP1.7)
LB_OUT1: main (U1.34), connectors (XP1.2)
LB_OUT2: main (U1.33), connectors (XP1.3)
M1_IN1: main (U1.96), drv (R6.1 U2.3 U3.3)
M1_IN2: main (U1.95), drv (R4.1 U2.2 U3.2)
M1_OUT1: drv (U2.6 U3.6), connectors (XP16.2)
M1_OUT2: drv (U2.8 U3.8), connectors (XP16.1)
M2_IN1: main (U1.65), drv (R7.1 U4.3 U5.3)
M2_IN2: main (U1.66), drv (R5.1 U4.2 U5.2)
M2_OUT1: drv (U4.6 U5.6), connectors (XP17.2)
M2_OUT2: drv (U4.8 U5.8), connectors (XP17.1)
M3_IN1: main (U1.32), drv (R10.1 U6.3 U7.3)
M3_IN2: main (U1.31), drv (R8.1 U6.2 U7.2)
M3_OUT1: drv (U6.6 U7.6), connectors (XP18.2)
M3_OUT2: drv (U6.8 U7.8), connectors (XP18.1)
M4_IN1: main (U1.36), drv (R11.1 U8.3 U9.3)
M4_IN2: main (U1.35), drv (R9.1 U8.2 U9.2)
M4_OUT1: drv (U8.6 U9.6), connectors (XP19.2)
M4_OUT2: drv (U8.8 U9.8), connectors (XP19.1)
MV_RX: main (U1.63), connectors (XP9.3)
MV_TX: main (U1.64), connectors (XP9.2)
SOL2: main (VD5.A VT2.D), connectors (XP6.2)
SPI2_MISO: main (U1.53), connectors (XP11.3)
SPI2_MOSI: main (U1.54), connectors (XP11.4)
SPI2_SCK: main (U1.52), connectors (XP11.2)
SWCLK: main (U1.76), connectors (J1.A7 J1.B7 VD1.K XP8.3)
SWDIO: main (U1.72), connectors (J1.A6 J1.B6 VD2.K XP8.1)
TB_IN1: main (U1.58), connectors (XP2.2)
TB_IN2: main (U1.57), connectors (XP2.3)
TB_IN3: main (U1.56), connectors (XP2.4)
TB_IN4: main (U1.55), connectors (XP2.5)
TB_OUT1: main (U1.17), connectors (XP2.6)
TB_OUT2: main (U1.16), connectors (XP2.7)
VBAT_ADC: main (U1.30), indicator (R51.1 R52.2)